# EAGLE design M177v2 (EAGLE 7.3.0)
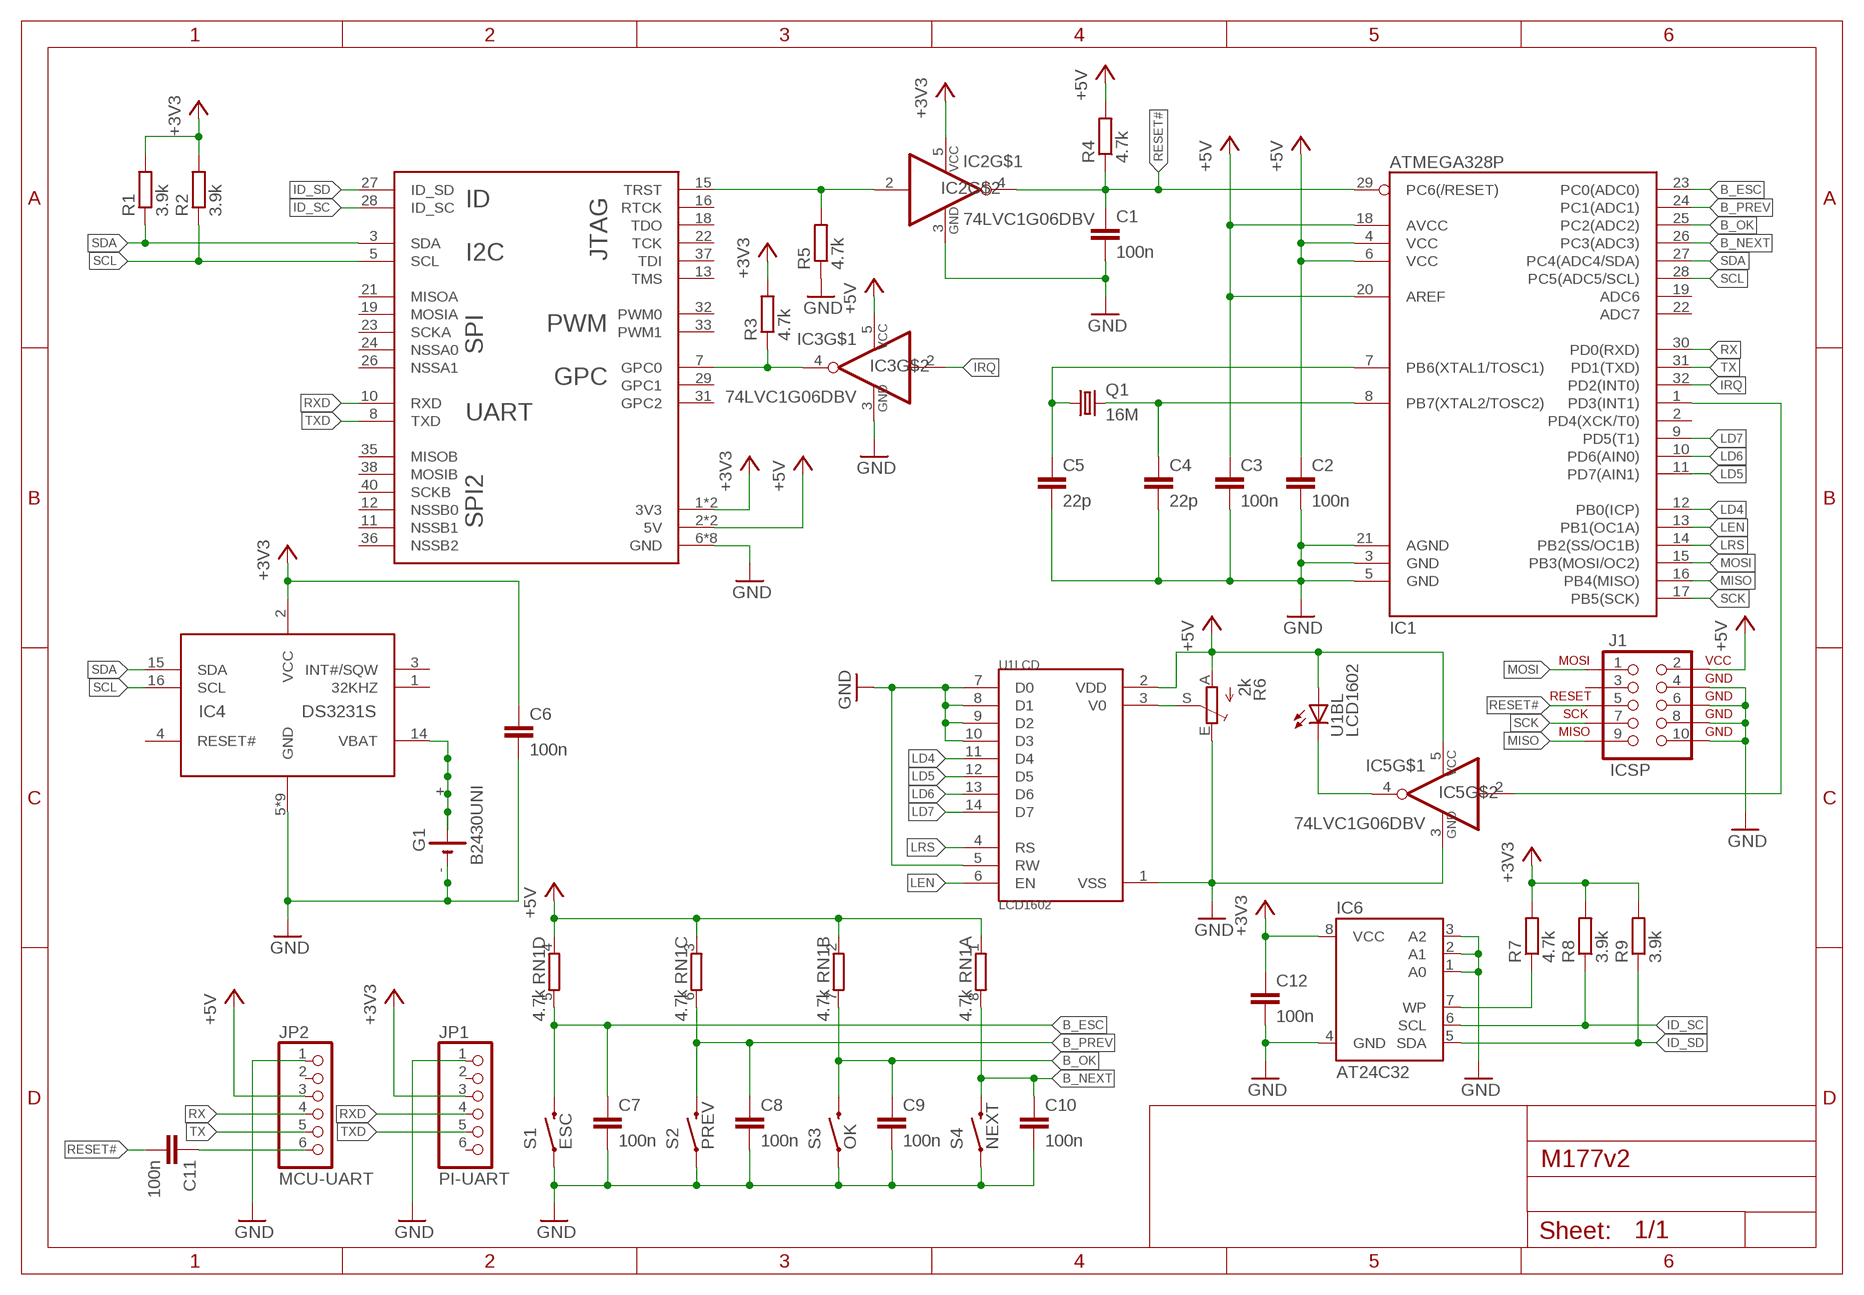
[diagram p0: schematic, sheet 1]

## Parts
C1  100n  C-EUC0603  [C0603]
C2  100n  C-EUC0603  [C0603]
C3  100n  C-EUC0603  [C0603]
C4  22p  C-EUC0603  [C0603]
C5  22p  C-EUC0603  [C0603]
C6  100n  C-EUC0603  [C0603]
C7  100n  C-EUC0603  [C0603]
C8  100n  C-EUC0603  [C0603]
C9  100n  C-EUC0603  [C0603]
C10  100n  C-EUC0603  [C0603]
C11  100n  C-EUC0603  [C0603]
C12  100n  C-EUC0603  [C0603]
G1  B2430UNI  [B2430UNI]
IC1  ATMEGA328P  ATMEGA328_SMT  [TQFP32-08]
IC2  74LVC1G06DBV  [SOT23-5]
IC3  74LVC1G06DBV  [SOT23-5]
IC4  DS3231S  [SO16W]
IC5  74LVC1G06DBV  [SOT23-5]
IC6  AT24C32  AT24CH  [SO-08]
J1  ICSP  AVR_SPI_PROG2PTH2  [2X5-SHROUDED]
JP1  PI-UART  PINHD-1X6  [1X06]
JP2  MCU-UART  PINHD-1X6  [1X06]
Q1  16M  CRYSTALHC49S  [HC49/S]
R1  3.9k  R-EU_R0603  [R0603]
R2  3.9k  R-EU_R0603  [R0603]
R3  4.7k  R-EU_R0603  [R0603]
R4  4.7k  R-EU_R0603  [R0603]
R5  4.7k  R-EU_R0603  [R0603]
R6  2k  TRIM_EU-CA6V  [CA6V]
R7  4.7k  R-EU_R0603  [R0603]
R8  3.9k  R-EU_R0603  [R0603]
R9  3.9k  R-EU_R0603  [R0603]
RN1  4.7k  4R-N0603-ARV  [0603-ARV]
S1  ESC  SWITCH-MOMENTARY-2-SMD-1101NE  [TACTILE-SWITCH-1101NE]
S2  PREV  SWITCH-MOMENTARY-2-SMD-1101NE  [TACTILE-SWITCH-1101NE]
S3  OK  SWITCH-MOMENTARY-2-SMD-1101NE  [TACTILE-SWITCH-1101NE]
S4  NEXT  SWITCH-MOMENTARY-2-SMD-1101NE  [TACTILE-SWITCH-1101NE]
U1  LCD1602  [LCD1602A]
U2  RASPI-B+H  [HAT]

## Nets
+3V3: C6.1 C12.1 IC2.5(VCC) IC4.2(VCC) IC6.8(VCC) JP1.3 R1.2 R2.2 R3.2 R7.2 R8.2 R9.2 U2.1(3V3) U2.17(3V3)
+5V: C2.1 C3.1 IC1.4(VCC) IC1.6(VCC) IC1.18(AVCC) IC1.20(AREF) IC3.5(VCC) IC5.5(VCC) J1.2(VCC) JP2.3 R4.2 R6.A RN1.1 RN1.2 RN1.3 RN1.4 U1.2(LCD:VDD) U1.15(BL:A) U2.2(5V) U2.4(5V)
B_ESC: C7.1 IC1.23(PC0(ADC0)) RN1.5 S1.2
B_NEXT: C10.1 IC1.26(PC3(ADC3)) RN1.8 S4.2
B_OK: C9.1 IC1.25(PC2(ADC2)) RN1.7 S3.2
B_PREV: C8.1 IC1.24(PC1(ADC1)) RN1.6 S2.2
GND: C1.2 C2.2 C3.2 C4.2 C5.2 C6.2 C7.2 C8.2 C9.2 C10.2 C12.2 G1.- G1.-@1(-) IC1.3(GND) IC1.5(GND) IC1.21(AGND) IC2.3(GND) IC3.3(GND) IC4.5(GND) IC4.6(GND) IC4.7(GND) IC4.8(GND) IC4.9(GND) IC4.10(GND) IC4.11(GND) IC4.12(GND) IC4.13(GND) IC5.3(GND) IC6.1(A0) IC6.2(A1) IC6.3(A2) IC6.4(GND) J1.4(GND) J1.6(GND) J1.8(GND) J1.10(GND) JP1.1 JP2.1 R5.1 R6.E S1.1 S2.1 S3.1 S4.1 U1.1(LCD:VSS) U1.5(LCD:RW) U1.7(LCD:D0) U1.8(LCD:D1) U1.9(LCD:D2) U1.10(LCD:D3) U2.6(GND) U2.9(GND) U2.14(GND) U2.20(GND) U2.25(GND) U2.30(GND) U2.34(GND) U2.39(GND)
ID_SC: IC6.6(SCL) R8.1 U2.28(ID_SC)
ID_SD: IC6.5(SDA) R9.1 U2.27(ID_SD)
IRQ: IC1.32(PD2(INT0)) IC3.2(I)
IRQ#: IC3.4(O) R3.1 U2.7(GPC0)
LD4: IC1.12(PB0(ICP)) U1.11(LCD:D4)
LD5: IC1.11(PD7(AIN1)) U1.12(LCD:D5)
LD6: IC1.10(PD6(AIN0)) U1.13(LCD:D6)
LD7: IC1.9(PD5(T1)) U1.14(LCD:D7)
LEN: IC1.13(PB1(OC1A)) U1.6(LCD:EN)
LRS: IC1.14(PB2(SS/OC1B)) U1.4(LCD:RS)
MISO: IC1.16(PB4(MISO)) J1.9(MISO)
MOSI: IC1.15(PB3(MOSI/OC2)) J1.1(MOSI)
N$1: G1.+ G1.+@1(+) G1.+@2(+) G1.+@3(+) G1.+@4(+) IC4.14(VBAT)
N$2: C4.1 IC1.8(PB7(XTAL2/TOSC2)) Q1.2
N$3: IC2.2(I) R5.2 U2.15(TRST)
N$4: R6.S U1.3(LCD:V0)
N$5: C5.1 IC1.7(PB6(XTAL1/TOSC1)) Q1.1
N$6: IC5.4(O) U1.16(BL:C)
N$7: IC1.1(PD3(INT1)) IC5.2(I)
N$8: C11.1 JP2.6
N$9: IC6.7(WP) R7.1
RESET#: C1.1 C11.2 IC1.29(PC6(/RESET)) IC2.4(O) J1.5(RESET) R4.1
RX: IC1.30(PD0(RXD)) JP2.4
RXD: JP1.4 U2.10(RXD)
SCK: IC1.17(PB5(SCK)) J1.7(SCK)
SCL: IC1.28(PC5(ADC5/SCL)) IC4.16(SCL) R2.1 U2.5(SCL)
SDA: IC1.27(PC4(ADC4/SDA)) IC4.15(SDA) R1.1 U2.3(SDA)
TX: IC1.31(PD1(TXD)) JP2.5
TXD: JP1.5 U2.8(TXD)
Unconnected: IC1.2(PD4(XCK/T0)) IC1.19(ADC6) IC1.22(ADC7) IC4.1(32KHZ) IC4.3(INT#/SQW) IC4.4(RESET#) J1.3(NC) JP1.2 JP1.6 JP2.2 U2.11(NSSB1) U2.12(NSSB0) U2.13(TMS) U2.16(RTCK) U2.18(TDO) U2.19(MOSIA) U2.21(MISOA) U2.22(TCK) U2.23(SCKA) U2.24(NSSA0) U2.26(NSSA1) U2.29(GPC1) U2.31(GPC2) U2.32(PWM0) U2.33(PWM1) U2.35(MISOB) U2.36(NSSB2) U2.37(TDI) U2.38(MOSIB) U2.40(SCKB)

## Library data of the parts
C1-C12 = rcl:C-EU: CAPACITOR, European symbol
G1 = battery:B2430UNI: LI BATTERY
IC1 = SparkFun-DigitalIC:ATMEGA328_SMT: 32-Pin Atmega328 part Commonly used on Arduino compatible boards Available in QFP and QFN packages TQFP is IC-09069 QFN is non-stock; PROD_ID: IC-09069
IC2 IC3 IC5 = 74xx-little-us:74*1G06: Single Inverter Buffer/Driver With Open-Drain Output
IC4 = M101:DS3231
IC6 = Modules:AT24C*: 2-wire serial EEPROM
J1 = SparkFun-Connectors:AVR_SPI_PROG2: AVR 10-pin ICSP Header This is the standard AVR In Circuit Serial Programming header. Minimal, but includes pin one indicator. Works with standard Olimex programmers. Also look for the 6-pin reduced version. Spark Fun Electronics SKU: PRT-00778
JP1 JP2 = pinhead:PINHD-1X6: PIN HEADER
Q1 = crystal:CRYSTAL: CRYSTAL; OC_FARNELL: 1667008; OC_NEWARK: unknown
R1-R5 R7-R9 = rcl:R-EU_: RESISTOR, European symbol
R6 = pot:TRIM_EU-: POTENTIOMETER
RN1 = resistor-dil:4R-N: Array Chip Resistor Source: RS Component / Phycomp; OC_FARNELL: unknown; OC_NEWARK: unknown
S1-S4 = SparkFun-Electromechanical:SWITCH-MOMENTARY-2: Various NO switches- pushbuttons, reed, etc
U1 = Modules:LCD1602
U2 = Modules:RASPI-B+: Raspberry Pi Model B+ This model is the 40-way GPIO pins of Raspberry Pi model B+.

## Board
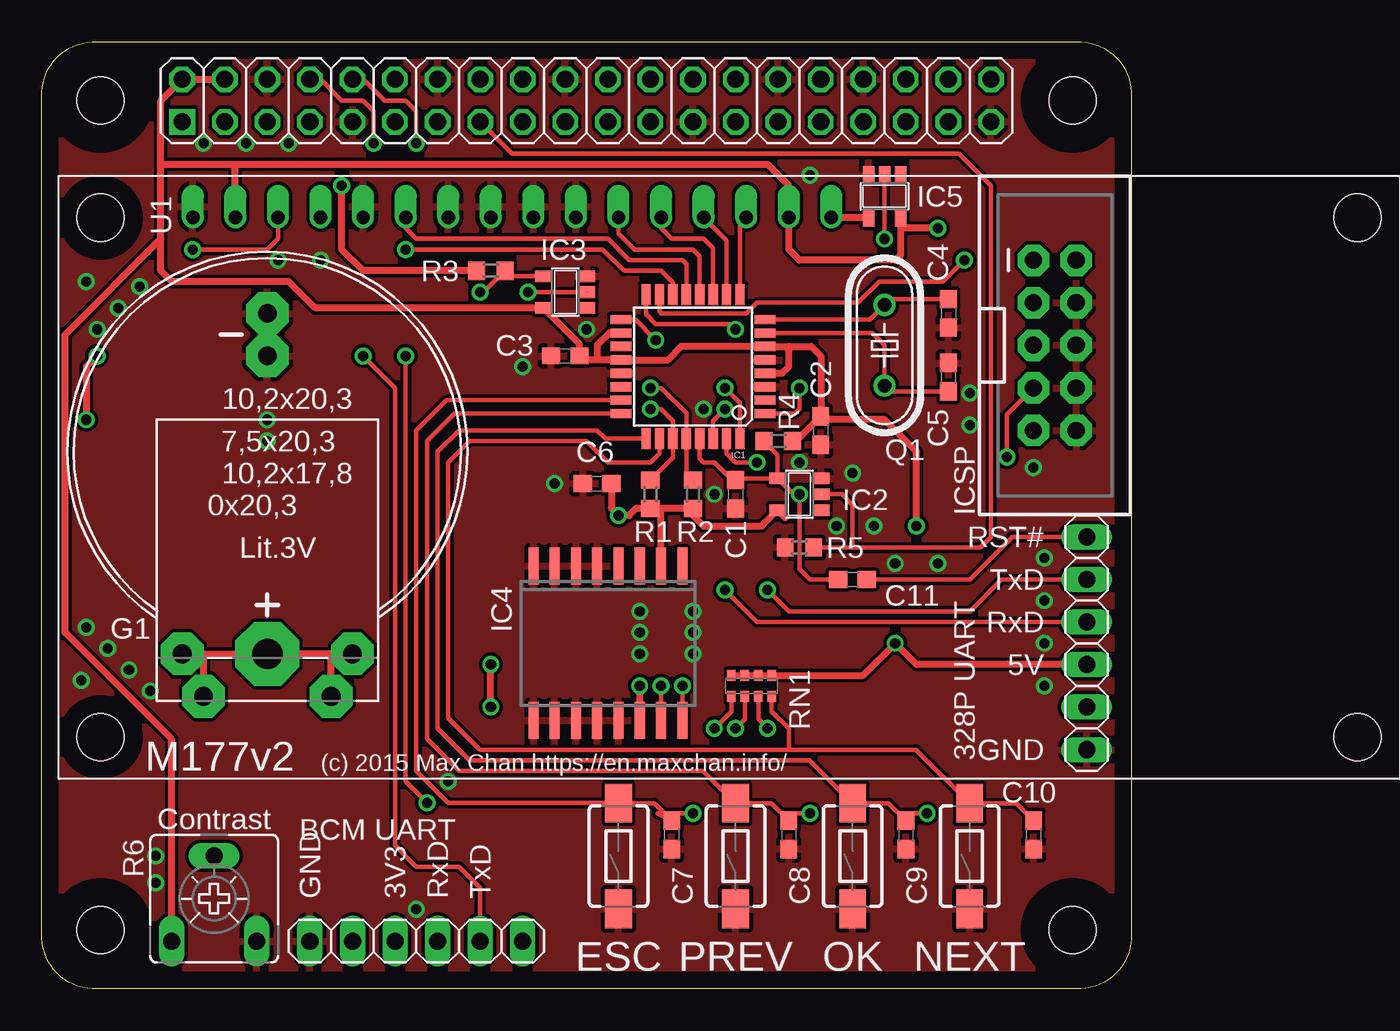
[diagram p1: board, top side]
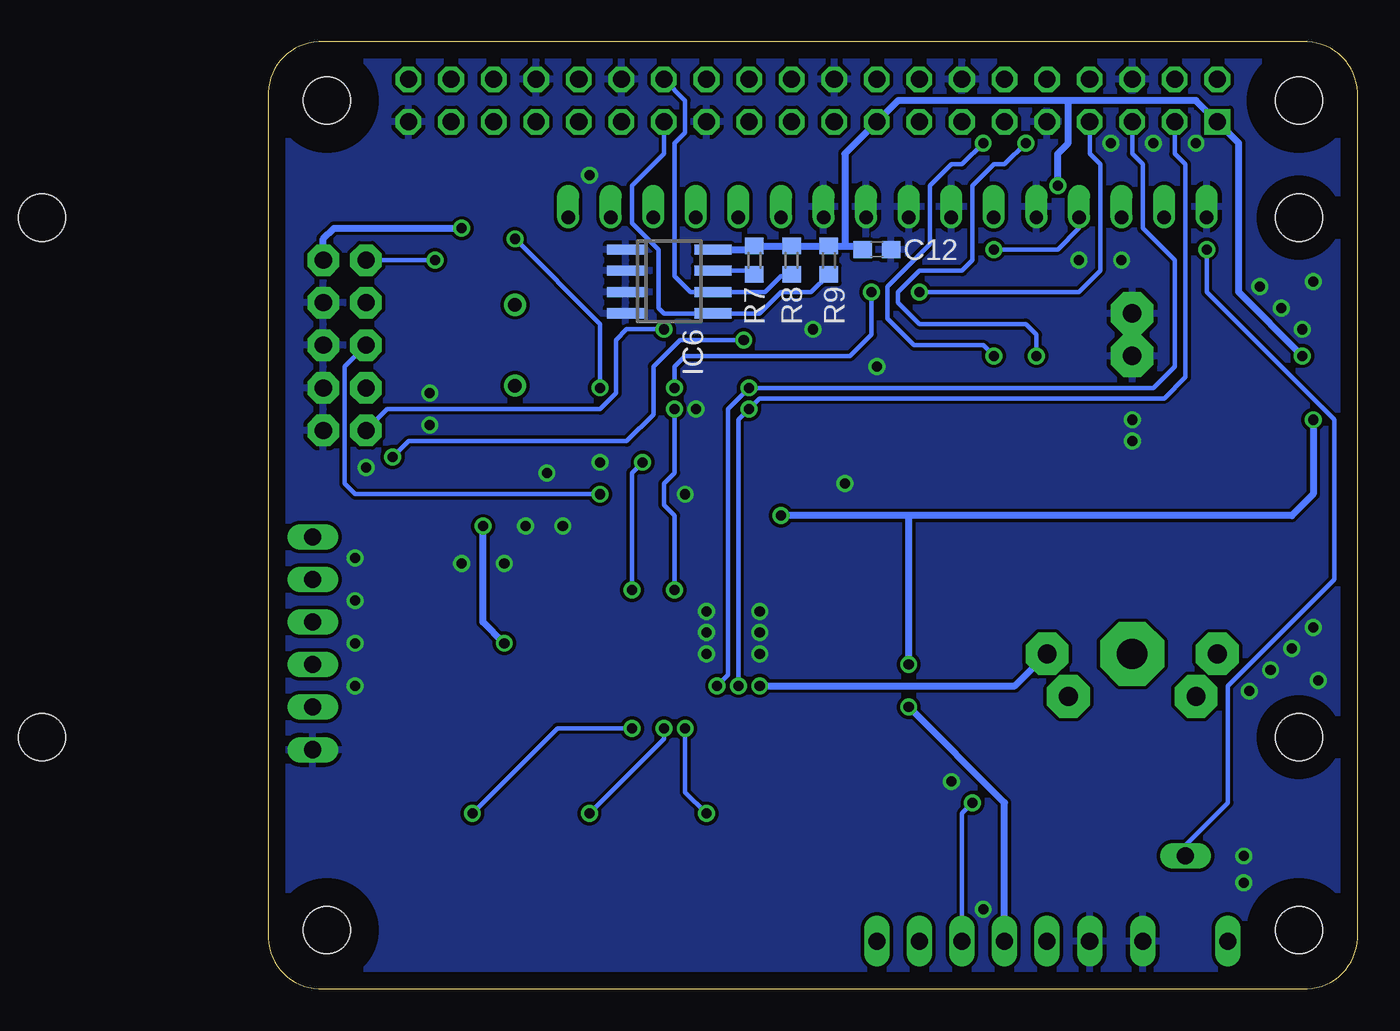
[diagram p2: board, bottom side, seen from below]

Size 65 x 56.5 mm. Coordinates in mm from the lower left corner, seen from the top.
Copper layers (1*16): Top 0.035mm / dielectric 1.5mm / Bottom 0.035mm
Design rules "default": minimum track width 10mil, minimum drill 24mil, track to track 8mil, track to pad 8mil, pad to pad 8mil, via to via 8mil, smd to smd 8mil, copper to edge 40mil, drill to drill 8mil, minimum pad ring 10mil, minimum via ring 8mil, stop-mask expansion 4mil, vias tented up to drill 0mil, thermal gap 10mil

### Footprints (pad centres in the part's own frame; a part is rotated, then mirrored left to right if it is on the bottom)
C0603 = smd 1.1 x 1: 1 -0.85,0; 2 0.85,0
B2430UNI = drill 1.118 pad 2.54 octagon: + 3.81,14.605; +@1 -3.81,14.605; +@2 -5.08,12.065; +@3 5.08,12.065; - 0,-5.715; -@1 0,-8.255 | drill 1.803 pad 3.81 octagon: +@4 0,12.065
TQFP32-08 = smd 1.27 x 0.559: 1 -4.293,2.8; 2 -4.293,2; 3 -4.293,1.2; 4 -4.293,0.4; 5 -4.293,-0.4; 6 -4.293,-1.2; 7 -4.293,-2; 8 -4.293,-2.8; 17 4.293,-2.8; 18 4.293,-2; 19 4.293,-1.2; 20 4.293,-0.4; 21 4.293,0.4; 22 4.293,1.2; 23 4.293,2; 24 4.293,2.8 | smd 0.559 x 1.27: 9 -2.8,-4.293; 10 -2,-4.293; 11 -1.2,-4.293; 12 -0.4,-4.293; 13 0.4,-4.293; 14 1.2,-4.293; 15 2,-4.293; 16 2.8,-4.293; 25 2.8,4.293; 26 2,4.293; 27 1.2,4.293; 28 0.4,4.293; 29 -0.4,4.293; 30 -1.2,4.293; 31 -2,4.293; 32 -2.8,4.293
SOT23-5 = smd 0.69 x 0.99: 1 -0.95,-1.29; 2 0,-1.29; 3 0.95,-1.29; 4 0.95,1.3; 5 -0.95,1.3
SO16W = smd 0.6 x 2.2: 1 -4.445,-4.6; 2 -3.175,-4.6; 3 -1.905,-4.6; 4 -0.635,-4.6; 5 0.635,-4.6; 6 1.905,-4.6; 7 3.175,-4.6; 8 4.445,-4.6; 9 4.445,4.6; 10 3.175,4.6; 11 1.905,4.6; 12 0.635,4.6; 13 -0.635,4.6; 14 -1.905,4.6; 15 -3.175,4.6; 16 -4.445,4.6
SO-08 = smd 0.6 x 2.2: 1 -1.905,-2.6; 2 -0.635,-2.6; 3 0.635,-2.6; 4 1.905,-2.6; 5 1.905,2.6; 6 0.635,2.6; 7 -0.635,2.6; 8 -1.905,2.6
2X5-SHROUDED = drill 1.016 pad 1.88 octagon: 1 -1.27,5.08; 2 1.27,5.08; 3 -1.27,2.54; 4 1.27,2.54; 5 -1.27,0; 6 1.27,0; 7 -1.27,-2.54; 8 1.27,-2.54; 9 -1.27,-5.08; 10 1.27,-5.08
1X06 = drill 1.016 long: 1 -6.35,0; 2 -3.81,0; 3 -1.27,0; 4 1.27,0; 5 3.81,0; 6 6.35,0
HC49/S = drill 0.813: 1 -2.413,0; 2 2.413,0
R0603 = smd 1 x 1.1: 1 -0.85,0; 2 0.85,0
CA6V = drill 1.016 long: A -2.54,-2.54; E 2.54,-2.54; S 0,2.54
0603-ARV = smd 0.5 x 0.65: 1 -1.2,-0.625; 2 -0.4,-0.625; 3 0.4,-0.625; 4 1.2,-0.625; 5 1.2,0.625; 6 0.4,0.625; 7 -0.4,0.625; 8 -1.2,0.625
TACTILE-SWITCH-1101NE = smd 2.3 x 1.6: 1 -3.15,0; 2 3.15,0
LCD1602A = drill 0.8 offset: 1 0,0; 2 2.54,0; 3 5.08,0; 4 7.62,0; 5 10.16,0; 6 12.7,0; 7 15.24,0; 8 17.78,0; 9 20.32,0; 10 22.86,0; 11 25.4,0; 12 27.94,0; 13 30.48,0; 14 33.02,0; 15 35.56,0; 16 38.1,0 | hole 2.8: -5.5,0; -5.5,-31; 69.5,0; 69.5,-31
HAT = drill 1.016 square: 1 -24.13,-1.27 | drill 1.016 octagon: 2 -24.13,1.27; 3 -21.59,-1.27; 4 -21.59,1.27; 5 -19.05,-1.27; 6 -19.05,1.27; 7 -16.51,-1.27; 8 -16.51,1.27; 9 -13.97,-1.27; 10 -13.97,1.27; 11 -11.43,-1.27; 12 -11.43,1.27; 13 -8.89,-1.27; 14 -8.89,1.27; 15 -6.35,-1.27; 16 -6.35,1.27; 17 -3.81,-1.27; 18 -3.81,1.27; 19 -1.27,-1.27; 20 -1.27,1.27; 21 1.27,-1.27; 22 1.27,1.27; 23 3.81,-1.27; 24 3.81,1.27; 25 6.35,-1.27; 26 6.35,1.27; 27 8.89,-1.27; 28 8.89,1.27; 29 11.43,-1.27; 30 11.43,1.27; 31 13.97,-1.27; 32 13.97,1.27; 33 16.51,-1.27; 34 16.51,1.27; 35 19.05,-1.27; 36 19.05,1.27; 37 21.59,-1.27; 38 21.59,1.27; 39 24.13,-1.27; 40 24.13,1.27 | hole 2.8: -29,-49.5; 29,-49.5; -29,0; 29,0

### Placement (x,y rotation side)
C1  41.39,29.5 270 top
C2  46.47,33.31 270 top
C3  31.23,37.76 180 top
C4  54.09,40.3 270 top
C5  54.09,36.49 90 top
C6  33.13,30.14 180 top
C7  37.58,9.18 270 top
C8  44.56,9.18 270 top
C9  51.55,9.18 270 top
C10  59.17,9.18 270 top
C11  48.38,24.42 180 top
C12  28.69,44.11 0 bottom
G1  13.45,32.05 180 top
IC1  38.85,37.12 180 top
IC2  45.2,29.5 90 top
IC3  31.23,41.57 90 top
IC4  33.77,20.61 180 top
IC5  50.28,47.28 180 top
IC6  41.07,42.2 270 bottom
J1  60.44,38.39 0 top
JP1  22.34,2.83 0 top
JP2  62.34,20.61 90 top
Q1  50.28,38.39 90 top
R1  36.31,29.5 270 top
R2  38.85,29.5 270 top
R3  26.78,42.84 180 top
R4  43.93,32.68 0 top
R5  45.2,26.33 0 top
R6  10.27,5.37 0 top
R7  35.99,43.48 90 bottom
R8  33.77,43.48 90 bottom
R9  31.55,43.48 90 bottom
RN1  42.34,18.07 180 top
S1  34.4,7.91 90 top
S2  41.39,7.91 90 top
S3  48.38,7.91 90 top
S4  55.36,7.91 90 top
U1  9,46.02 0 top
U2  32.5,53 0 top

### Tracks (layer width: path | path; a pad name or v marks a point on that pad's centre or on a via)
+3V3  (via drill 0.6)
  Top 0.406: 36.95,28.65 R2.2 38.85,28.23 39.48,27.6 42.95,27.6 IC2.5 44.35,28.1 | 36.95,28.65 R1.2 35.46,28.65 35.04,28.23 v34.4,28.23 33.98,28.65 C6.1 | IC4.2 36.95,28.65 | v3.29,37.76 2.65,37.12 v2.65,33.95 | R3.2 19.16,42.84 17.89,44.11 v17.89,47.92 | v26.78,16.8 v26.78,19.34
  Bottom 0.406: v3.29,37.76 7.1,41.57 7.1,50.46 U2.1 9.64,53 17.26,53 | v17.89,47.92 17.89,49.82 17.26,50.46 17.26,53 | 17.26,53 27.42,53 U2.17 30.59,49.82 30.59,44.32 | v2.65,33.95 2.65,29.5 3.92,28.23 26.78,28.23 | 26.78,28.23 v34.4,28.23 | v26.78,16.8 21.07,11.09 JP1.3 | v26.78,19.34 26.78,28.23 | IC6.8 36.21,44.11 R7.2 R8.2 R9.2 30.59,44.32 | 30.59,44.32 29.75,44.32 C12.1
+5V  (via drill 0.6)
  Top 0.406: U2.4 U2.2 7.1,53 7.1,49.19 | 33.13,37.52 IC1.20 37.34,37.52 38.14,38.32 IC1.6 44.56,38.32 | 33.13,37.52 32.31,37.52 C3.1 32.08,38.47 IC3.5 16.3,40.62 14.72,42.2 7.73,42.2 7.1,42.84 7.1,44.74 | 7.1,44.74 7.1,49.19 | 44.56,38.32 45.9,38.32 46.47,37.76 C2.1 | R4.2 44.98,32.68 C2.1 | IC1.4 44.16,36.73 44.56,37.12 44.56,38.32 | U1.2 11.54,49.19 | R6.A 7.73,14.9 1.38,21.25 1.38,39.03 7.1,44.74 | 7.1,49.19 11.54,49.19 | 11.54,49.19 43.29,49.19 44.56,47.92 U1.15 44.56,44.11 45.2,43.48 50.91,43.48 51.23,43.79 51.23,45.38 | IC5.5 51.23,45.38 | v53.45,45.38 51.23,45.38 | RN1.4 RN1.3 RN1.2 RN1.1 49,18.7 v50.91,20.61 52.18,19.34 JP2.3 | v52.18,27.6 52.18,32.05 50.28,33.95 46.68,33.95 C2.1 | IC1.18 33.86,39.12 33.13,38.39 33.13,37.52
  Bottom 0.406: J1.2 61.71,44.74 61.07,45.38 v53.45,45.38 | v50.91,20.61 52.18,21.88 v52.18,27.6
B_ESC  (via drill 0.6)
  Top 0.254: IC1.23 24.15,35.12 22.34,33.31 22.34,12.99 24.24,11.09 35.01,11.09 S1.2 36.55,11.06 C7.1 36.73,10.45 v38.85,10.45 | RN1.5 41.14,16.56 v40.12,15.54
  Bottom 0.254: v40.12,15.54 40.12,11.72 v38.85,10.45
B_NEXT
  Top 0.254: IC1.26 36.85,31.95 36.31,31.41 33.77,31.41 32.5,32.68 25.51,32.68 24.24,31.41 24.24,16.17 26.15,14.26 44.56,14.26 | 44.56,14.26 52.16,14.26 S4.2 58.14,11.06 C10.1 | RN1.8 43.54,16.56 44.56,15.54 44.56,14.26
B_OK  (via drill 0.6)
  Top 0.254: IC1.25 33.62,32.83 33.13,33.31 24.88,33.31 23.61,32.05 23.61,15.54 25.51,13.63 45.81,13.63 S3.2 50.52,11.06 C9.1 51.97,10.45 v52.82,10.45 | RN1.7 42.74,16.09 v43.29,15.54
  Bottom 0.254: v43.29,15.54 47.74,15.54 v52.82,10.45
B_PREV  (via drill 0.6)
  Top 0.254: IC1.24 24.62,34.32 22.97,32.68 22.97,14.9 24.88,12.99 39.46,12.99 S2.2 43.53,11.06 C8.1 44.98,10.45 v45.83,10.45 | RN1.6 41.94,16.09 v41.39,15.54
  Bottom 0.254: v41.39,15.54 41.39,14.9 v45.83,10.45
GND  (via drill 0.6)
  other vias: 45.83,48.55 14.08,43.48 45.2,31.41 13.45,33.95 13.45,32.68 32.5,39.35 55.36,35.54 55.36,33.63 59.17,31.09 2.65,42.2 3.29,39.35 4.56,40.62 5.83,41.89 6.78,7.91 6.78,6.33 2.65,21.57 3.92,20.3 5.19,19.03 6.46,17.76 2.34,18.39 28.69,37.12 30.59,30.14 35.67,22.52 35.67,21.25 35.67,19.98 38.85,22.52 38.85,21.25 38.85,19.98 16.62,43.48 12.18,50.46 14.72,50.46 9.64,50.46 40.12,29.5 48.38,30.77 49.64,27.6 59.8,18.07 59.8,20.61 59.8,25.7 59.8,23.15 39.48,34.59 22.34,4.74 24.24,12.36 50.91,25.38 53.45,25.38 47.42,27.6
  pour Top: 0.11,56.81 65.52,56.81 65.52,-0.34 0.11,-0.34
  pour Bottom: 0.11,-0.34 65.52,-0.34 65.52,56.81 0.11,56.81
ID_SC
  Bottom 0.254: U2.28 40.12,53 40.12,51.09 40.75,50.46 40.75,42.52 39.8,41.57 IC6.6 35.36,41.57 34.4,42.52 33.87,42.52 R8.1
ID_SD
  Bottom 0.254: R9.1 32.6,41.57 34.4,41.57 35.67,40.3 IC6.5 41.39,40.3 41.71,40.62 41.71,44.11 43.29,45.7 43.29,47.92 41.39,49.82 U2.27
IRQ  (via drill 0.6)
  Top 0.254: IC1.32 41.65,34.96 v40.75,35.85 | v29.01,41.57 IC3.2
  Bottom 0.254: v40.75,35.85 40.75,37.12 40.12,37.76 30.28,37.76 29.01,39.03 v29.01,41.57
IRQ#  (via drill 0.6)
  Top 0.254: IC3.4 27.95,42.52 R3.1 26.36,41.57 v26.15,41.57
  Bottom 0.254: v26.15,41.57 16.62,41.57 15.35,42.84 15.35,49.19 15.99,49.82 U2.7
LD4
  Top 0.254: IC1.12 39.25,43.71 38.85,44.11 35.36,44.11 34.4,45.06 U1.11
LD5
  Top 0.254: IC1.11 40.05,44.18 39.48,44.74 37.58,44.74 36.95,45.38 U1.12
LD6
  Top 0.254: IC1.10 40.85,44.65 U1.13
LD7
  Top 0.254: IC1.9 41.65,45.64 U1.14
LEN
  Top 0.254: IC1.13 38.45,43.24 38.21,43.48 35.04,43.48 33.77,44.74 22.34,44.74 21.7,45.38 U1.6
LRS  (via drill 0.6)
  Top 0.254: IC1.14 37.65,42.13 36.95,42.84 34.72,42.84 33.45,44.11 v21.7,44.11
  Bottom 0.254: v21.7,44.11 17.89,44.11 16.62,45.38 U1.4
MISO  (via drill 0.6)
  Top 0.254: IC1.16 36.05,40.24 36.63,39.66 41.07,39.66 v41.39,39.35
  Bottom 0.254: v41.39,39.35 43.61,39.35 44.25,38.71 44.25,35.54 45.2,34.59 57.9,34.59 J1.9
MOSI  (via drill 0.6)
  Top 0.254: IC1.15 36.85,40.39 36.95,40.3 42.02,40.3 42.66,40.93 48.69,40.93 49.96,42.2 53.77,42.2 v55.04,43.48
  Bottom 0.254: v55.04,43.48 J1.1
N$1  (via drill 0.6)
  Top 0.406: G1.+@3 9.64,19.98 | 9.64,19.98 G1.+@4 17.26,19.98 | G1.+@2 17.26,19.98 | G1.+ 9.64,19.98 | G1.+@1 17.26,19.98 | IC4.14 v35.67,18.07
  Bottom 0.406: v35.67,18.07 20.43,18.07 G1.+@2
N$2
  Top 0.254: IC1.8 49.4,39.92 Q1.2 50.62,41.15 C4.1
N$3
  Top 0.254: U2.15 28.05,49.82 54.72,49.82 56.63,47.92 56.63,26.96 55.99,26.33 48.38,26.33 | IC2.2 47.74,29.5 48.38,28.87 48.38,26.65 48.38,26.33 | R5.2 48.38,26.33
N$4  (via drill 0.6)
  Top 0.254: v9,44.11 13.45,44.11 14.08,44.74 U1.3
  Bottom 0.254: R6.S 10.27,8.55 7.73,11.09 7.73,18.07 1.38,24.42 1.38,33.95 9,41.57 v9,44.11
N$5
  Top 0.254: IC1.7 49.55,39.12 50.28,38.39 Q1.1 50.62,35.64 C5.1
N$6
  Top 0.406: IC5.4 49.3,46.02 U1.16
N$7  (via drill 0.6)
  Top 0.254: IC5.2 v50.28,44.74 | IC1.1 44.94,34.32 45.2,34.59 v45.2,35.85
  Bottom 0.254: v50.28,44.74 45.2,39.66 v45.2,35.85
N$8
  Top 0.254: C11.1 55.36,24.42 57.9,26.96 JP2.6
N$9
  Bottom 0.254: IC6.7 36.21,42.84 R7.1
RESET#  (via drill 0.6)
  Top 0.254: IC1.29 39.25,31.64 39.48,31.41 40.12,31.41 41.17,30.35 C1.1 41.49,30.45 IC2.4 | IC2.4 43.9,31.86 R4.1 | IC2.4 44.85,29.5 v45.2,29.5 45.2,25.06 45.83,24.42 C11.2
  Bottom 0.254: J1.5 60.44,37.12 60.44,30.14 59.8,29.5 v45.2,29.5
RX  (via drill 0.6)
  Top 0.254: IC1.30 40.05,33.88 v40.75,34.59 | JP2.4 42.66,21.88 v40.75,23.79
  Bottom 0.254: v40.75,23.79 40.75,28.23 41.39,28.87 41.39,30.14 40.75,30.77 v40.75,34.59
RXD  (via drill 0.6)
  Top 0.254: U2.10 19.16,54.27 20.43,53 21.7,53 22.34,52.37 v22.34,50.46 | v21.7,37.76 21.7,12.36 v22.97,11.09
  Bottom 0.254: v22.34,50.46 23.61,49.19 24.24,49.19 25.51,47.92 25.51,44.43 28.05,41.89 28.05,39.98 26.47,38.39 22.34,38.39 v21.7,37.76 | v22.97,11.09 23.61,10.45 JP1.4
SCK  (via drill 0.6)
  Top 0.254: IC1.17 35.41,39.92 v36.63,38.71 | v57.58,31.73 57.58,34.27 J1.7
  Bottom 0.254: v36.63,38.71 40.44,38.71 42.02,37.12 42.02,34.27 43.61,32.68 56.63,32.68 v57.58,31.73
SCL  (via drill 0.6)
  Top 0.254: R2.1 38.45,30.75 IC1.28 38.45,34.35 36.95,35.85 v36.31,35.85 | IC4.16 v38.21,18.07
  Bottom 0.254: v38.21,18.07 37.58,18.71 37.58,34.59 v36.31,35.85 12.18,35.85 10.91,37.12 10.91,43.48 12.81,45.38 12.81,49.19 13.45,49.82 U2.5
SDA  (via drill 0.6)
  Top 0.254: R1.1 37.65,31.7 IC1.27 37.65,33.88 36.95,34.59 v36.31,34.59 | IC4.15 v36.95,18.07
  Bottom 0.254: v36.95,18.07 36.95,33.95 v36.31,34.59 35.67,35.22 11.54,35.22 10.27,36.49 10.27,49.19 10.91,49.82 U2.3
TX  (via drill 0.6)
  Top 0.254: IC1.31 40.85,31.95 41.39,31.41 v42.66,31.41 | JP2.5 57.26,24.42 55.36,22.52 44.56,22.52 v43.29,23.79
  Bottom 0.254: v42.66,31.41 43.29,30.77 v43.29,23.79
TXD  (via drill 0.6)
  Top 0.254: U2.8 16.62,54.27 17.89,53 19.16,53 19.8,52.37 v19.8,50.46 | v19.16,37.76 21.07,35.85 21.07,8.55 22.34,7.28 24.88,7.28 26.15,6.01 JP1.5
  Bottom 0.254: v19.8,50.46 21.07,49.19 21.7,49.19 22.97,47.92 22.97,43.48 23.61,42.84 26.15,42.84 27.42,41.57 27.42,40.93 26.15,39.66 19.8,39.66 19.16,39.03 v19.16,37.76

### Text on the board
tPlace: ICSP | RST# | TxD | RxD | 5V | 328P UART | GND | M177v2 | (c) 2015 Max Chan https://en.maxchan.info/ | Contrast | BCM UART | GND | 3V3 | RxD | TxD | ESC | PREV | OK | NEXT